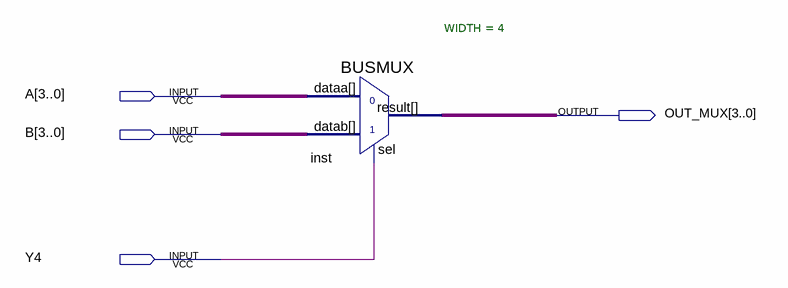
[diagram p0: schematic sheet]
// Quartus schematic MUX_AB.bdf as structural Verilog: 1 symbols, 4 pins
module MUX_AB (
  input  [3:0] A,
  input  [3:0] B,
  input  Y4,
  output [3:0] OUT_MUX
);

  BUSMUX #(.WIDTH(4)) inst (.datab(B), .sel(Y4), .dataa(A), .result(OUT_MUX));
endmodule
